# Altium schematic sheet Camera Schematic.SchDoc: Camera Schematic
size A4; Organization: Altium Limited; Address1: L3, 12a Rodborough Rd; Address2: Frenchs Forest; Address3: NSW; Address4: Australia 2086; DocumentNumber: 1; Revision: V1.0; SheetNumber: 1; SheetTotal: 1
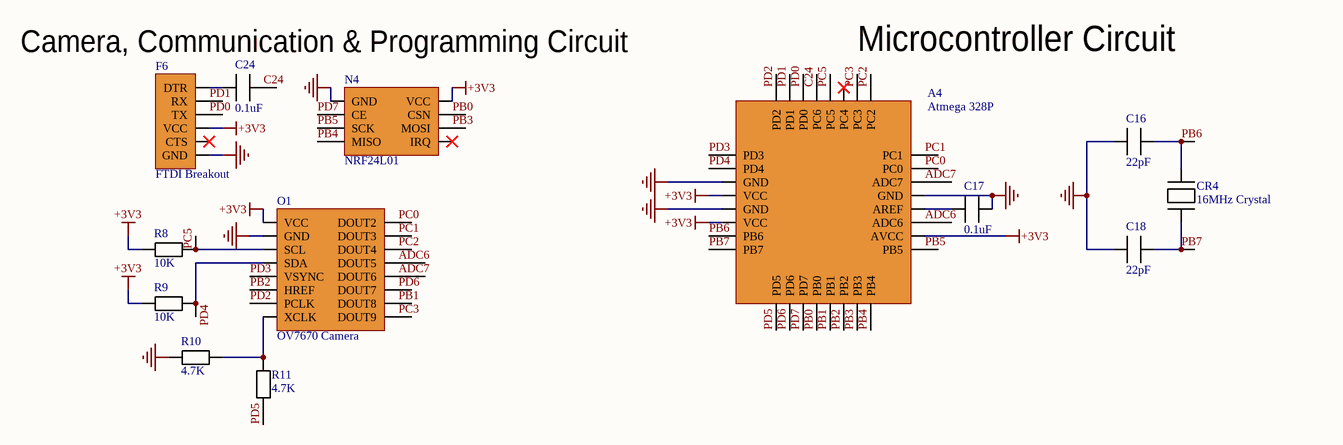
[diagram p0: Camera Schematic.SchDoc]

## Parts
A4  Atmega 328P  [ATMega328P]
C16  22pF  [22pF Capacitor]
C17  0.1uF  [0.1uF Capacitor]
C18  22pF  [22pF Capacitor]
C24  0.1uF  [0.1uF Capacitor]
CR4  16MHz Crystal  [16MHz Crystal]
F6  FTDI Breakout  [FTDI]
N4  NRF24L01  [NRF24L01]
O1  OV7670 Camera  [OV7670 Camera Module]
R8  10K  [10K Resistor]
R9  10K  [10K Resistor]
R10  4.7K  [4.7K Resistor]
R11  4.7K  [4.7K Resistor]

## Nets
+3V3: A4.4(VCC) A4.6(VCC) A4.18(AVCC) F6.4(VCC) N4.5(VCC) O1.1(VCC) R8.1 R9.1
GND: A4.3(GND) A4.5(GND) A4.21(GND) C16.1 C17.2 C18.1 F6.6(GND) N4.1(GND) O1.2(GND) R10.1
ADC6: A4.19(ADC6) O1.13(DOUT5)
ADC7: A4.22(ADC7) O1.12(DOUT6)
C24: A4.29(PC6) C24.2
PB0: A4.12(PB0) N4.6(CSN)
PB1: A4.13(PB1) O1.10(DOUT8)
PB2: A4.14(PB2) O1.6(HREF)
PB3: A4.15(PB3) N4.7(MOSI)
PB4: A4.16(PB4) N4.4(MISO)
PB5: A4.17(PB5) N4.3(SCK)
PB6: A4.7(PB6) C16.2 CR4.2
PB7: A4.8(PB7) C18.2 CR4.1
PC0: A4.23(PC0) O1.16(DOUT2)
PC1: A4.24(PC1) O1.15(DOUT3)
PC2: A4.25(PC2) O1.14(DOUT4)
PC3: A4.26(PC3) O1.9(DOUT9)
PC5: A4.28(PC5) O1.3(SCL) R8.2
PD0: A4.30(PD0) F6.3(TX)
PD1: A4.31(PD1) F6.2(RX)
PD2: A4.32(PD2) O1.7(PCLK)
PD3: A4.1(PD3) O1.5(VSYNC)
PD4: A4.2(PD4) O1.4(SDA) R9.2
PD5: A4.9(PD5) R11.1
PD6: A4.10(PD6) O1.11(DOUT7)
PD7: A4.11(PD7) N4.2(CE)
NetA4_20: A4.20(AREF) C17.1
NetC24_1: C24.1 F6.1(DTR)
NetO1_8: O1.8(XCLK) R10.2 R11.2

Not connected (* = marked no-connect by the designer): A4 27(PC4)*; F6 5(CTS)*; N4 8(IRQ)*

## Notes on the sheet
- Camera, Communication & Programming Circuit
- (near A4) Microcontroller Circuit
- Title
- Size:
- Date:
- A4
- Number:
- Time:
- Revision:
- Sheet
- of
- File:

## Library data of the parts
A4 = ATMEGA328PB-AUR: IC MCU 8BIT 32KB FLASH 32TQFP; Manufacturer: Microchip; Interface: I2C,SPI,UART,USART; Peripherals: Brown-out Detect/Reset,POR,PWM,WDT; Core Architecture: AVR; Frequency: 20MHz; Number of I/Os: 27; Oscillator Type: Internal; Supplier 1: Digi-Key; Manufacturer Part Number: ATMEGA328PB-AUR; RoHS: No; Category: Microcontrollers; Stock 1: 9971; Pricing 1: 1=1.42000, 25=1.30000, 100=1.18000 (USD); Case/Package: TQFP; Number of Pins: 32; Min Operating Temperature: -40°C; Max Operating Temperature: 85°C; Memory Type: FLASH; Packaging: Tape and Reel; Memory Size: 32KB; ComponentLink1URL: http://www.microchip.com/mymicrochip/filehandler.aspx?ddocname=en589666&src-supplier=Digi-Key; ComponentLink1Description: http://www.microchip.com/mymicrochip/filehandler.aspx?ddocname=en589666&src-supplier=Digi-Key; Supplier Part Number 1: ATMEGA328PB-AURCT-ND
C16 C18 = 06035A220JAT2A: Cap Ceramic 22pF 50V C0G 5% SMD 0603 125C Paper T/R; Manufacturer: Kyocera AVX; Insulation Resistance: 100GR; Temperature Coefficient: 30ppm/°C; Supplier 1: Digi-Key; Manufacturer Part Number: 06035A220JAT2A; RoHS: Yes; Category: Ceramic Capacitors; Stock 1: 678111; Pricing 1: 1=0.10000, 10=0.05600, 50=0.03040, 100=0.02480, 500=0.01772, 1000=0.01392 (USD); Mount: Surface Mount,PCB; Case/Package: 0603; Number of Pins: 2; Case Code (Imperial): 0603; Case Code (Metric): 1608; Contact Plating: Tin,Matte; Dielectric Material: Ceramic; Min Operating Temperature: -55°C; Max Operating Temperature: 125°C; Tolerance: 5%; Capacitance: 22pF; Voltage Rating (DC): 50V; Packaging: Tape and Reel; Dielectric: C0G; Voltage: 50V; Voltage Rating: 50V; Package Quantity: 1; Termination: SMD/SMT; Length: 1.6mm; Width: 0.81mm; Height: 0.63mm; Thickness: 0.035inch; Depth: 0.81mm; Radiation Hardening: No; REACH SVHC: No SVHC; Lead Free: Lead Free; ComponentLink1URL: https://datasheet.ciiva.com/11788/0900766b802d4697-11788031.pdf?src-supplier=RSComponents; ComponentLink1Description: https://datasheet.ciiva.com/11788/0900766b802d4697-11788031.pdf?src-supplier=RSComponents; ComponentLink2URL: https://datasheet.ciiva.com/16351/ccog-16351125.pdf?src-supplier=Future+Electronics; ComponentLink2Description: https://datasheet.ciiva.com/16351/ccog-16351125.pdf?src-supplier=Future+Electronics; ComponentLink3URL: https://datasheet.ciiva.com/1124/759117-1124728.pdf?src-supplier=Element14; ComponentLink3Description: https://datasheet.ciiva.com/1124/759117-1124728.pdf?src-supplier=Element14; ComponentLink4URL: https://datasheet.ciiva.com/7855/759117-7855064.pdf?src-supplier=Element14; ComponentLink4Description: https://datasheet.ciiva.com/7855/759117-7855064.pdf?src-supplier=Element14; ComponentLink5URL: https://datasheet.ciiva.com/150/ccog-150366.pdf?src-supplier=Digi-Key; ComponentLink5Description: https://datasheet.ciiva.com/150/ccog-150366.pdf?src-supplier=Digi-Key; ComponentLink6URL: https://datasheet.ciiva.com/150/ccog-150367.pdf?src-supplier=Digi-Key; ComponentLink6Description: https://datasheet.ciiva.com/150/ccog-150367.pdf?src-supplier=Digi-Key; Supplier Part Number 1: 478-1167-1-ND
C17 C24 = 06033C104KAT4A: CAP CER 0.1UF 25V X7R 0603; Manufacturer: Kyocera AVX; Capacitance: 100nF; Tolerance: 10%; Supplier 1: Digi-Key; Manufacturer Part Number: 06033C104KAT4A; RoHS: Yes; Category: Ceramic Capacitors; Stock 1: 6112957; Pricing 1: 1=0.10000, 10=0.04200, 50=0.02320, 100=0.01890, 500=0.01348, 1000=0.01059, 2500=0.00962, 5000=0.00886 (USD); Mount: Surface Mount; Case/Package: 0603; Number of Pins: 2; Case Code (Metric): 1608; Case Code (Imperial): 0603; Min Operating Temperature: -55°C; Max Operating Temperature: 125°C; Packaging: Tape and Reel; Voltage Rating (DC): 25V; Dielectric: X7R; Package Quantity: 1; Voltage Rating: 25V; Termination: SMD/SMT; Length: 1.6mm; Width: 0.032inch; Height: 0.9mm; Thickness: 0.035inch; Depth: 0.81mm; REACH SVHC: No SVHC; Lead Free: Lead Free; ComponentLink1URL: https://datasheet.ciiva.com/22619/1679506-22619862.pdf?src-supplier=Element14; ComponentLink1Description: https://datasheet.ciiva.com/22619/1679506-22619862.pdf?src-supplier=Element14; ComponentLink2URL: https://datasheet.ciiva.com/28613/1679506-28613035.pdf?src-supplier=Element14; ComponentLink2Description: https://datasheet.ciiva.com/28613/1679506-28613035.pdf?src-supplier=Element14; ComponentLink3URL: https://datasheet.ciiva.com/6277/cx7r-6277758.pdf?src-supplier=Digi-Key; ComponentLink3Description: https://datasheet.ciiva.com/6277/cx7r-6277758.pdf?src-supplier=Digi-Key; ComponentLink4URL: https://datasheet.ciiva.com/6277/cx7r-6277759.pdf?src-supplier=Digi-Key; ComponentLink4Description: https://datasheet.ciiva.com/6277/cx7r-6277759.pdf?src-supplier=Digi-Key; Supplier Part Number 1: 478-7018-1-ND
CR4 = ECS-160-20-3X-TR: CRYSTAL 16.0000MHZ 20PF SMD; Manufacturer: ECS International; Frequency Tolerance: 30ppm; ESR (Equivalent Series Resistance): 50R; Frequency Stability: 50ppm; Supplier 1: Digi-Key; Manufacturer Part Number: ECS-160-20-3X-TR; RoHS: Yes; Category: Crystals; Stock 1: 6685; Pricing 1: 1=0.35000, 10=0.28800, 50=0.25880, 100=0.23000, 500=0.21850, 1000=0.18400 (USD); Mount: Surface Mount; Min Operating Temperature: -10°C; Max Operating Temperature: 70°C; Package Quantity: 1; Frequency: 16MHz; Load Capacitance: 20pF; Packaging: Tape and Reel; Tolerance: 30ppm; Termination: SMD/SMT; Length: 0.276inch; Width: 0.161inch; Height: 0.091inch; Lead Free: Lead Free; ComponentLink1URL: https://datasheet.ciiva.com/852/csm-3x-852328.pdf?src-supplier=Digi-Key; ComponentLink1Description: https://datasheet.ciiva.com/852/csm-3x-852328.pdf?src-supplier=Digi-Key; ComponentLink2URL: https://datasheet.ciiva.com/852/csm-3x-852329.pdf?src-supplier=Digi-Key; ComponentLink2Description: https://datasheet.ciiva.com/852/csm-3x-852329.pdf?src-supplier=Digi-Key; ComponentLink3URL: https://datasheet.ciiva.com/852/csm-3x-852330.pdf?src-supplier=Digi-Key; ComponentLink3Description: https://datasheet.ciiva.com/852/csm-3x-852330.pdf?src-supplier=Digi-Key; Supplier Part Number 1: XC1776CT-ND
F6 = FTDI: FTDI USB to TTL serial converter module
N4 = NRF24L01: 3.3V NRF24L01 WIRELESS RF MODULE
O1 = OV7670 Camera Module: CMOS OV7670 Camera Module / 1/6-Inch 0.3-Megapixel Module
R8 R9 = RNCP0603FTD10K0: RES 10K OHM 1% 1/8W 0603; Manufacturer: Stackpole Electronics; Resistance: 10kR; Max Power Dissipation: 125mW; Temperature Coefficient: 100ppm/°C; Supplier 1: Digi-Key; Manufacturer Part Number: RNCP0603FTD10K0; RoHS: Yes; Category: Chip SMD Resistors; Stock 1: 180255; Pricing 1: 1=0.10000, 10=0.05800, 100=0.02360, 1000=0.01060, 2500=0.00920 (USD); Mount: Surface Mount; Case/Package: 0603; Contact Plating: Tin,Matte; Case Code (Imperial): 0603; Case Code (Metric): 1608; Min Operating Temperature: -55°C; Max Operating Temperature: 155°C; Resistor Type: Thin Film; Number of Terminations: 2; Packaging: Tape and Reel; Tolerance: 1%; Features: Moisture Resistant,Anti-Sulfur; Length: 0.059inch; Width: 0.031inch; Height: 0.02inch; Radiation Hardening: No; Lead Free: Lead Free; ComponentLink1URL: https://www.seielect.com/Catalog/SEI-rncp.pdf?src-supplier=Avnet; ComponentLink1Description: https://www.seielect.com/Catalog/SEI-rncp.pdf?src-supplier=Avnet; ComponentLink2URL: https://www.seielect.com/catalog/SEI-Packaging.pdf?src-supplier=Digi-Key; ComponentLink2Description: https://www.seielect.com/catalog/SEI-Packaging.pdf?src-supplier=Digi-Key; ComponentLink3URL: https://www.seielect.com/Catalog/SEI-rncp.pdf?src-supplier=Digi-Key; ComponentLink3Description: https://www.seielect.com/Catalog/SEI-rncp.pdf?src-supplier=Digi-Key; Supplier Part Number 1: RNCP0603FTD10K0CT-ND
R10 R11 = RMCF0603FT4K70: Res Thick Film 0603 4.7K Ohm 1% 1/10W 100ppm/C Molded SMD SMD Paper T/R; Manufacturer: Stackpole Electronics; Max Power Dissipation: 100mW; Temperature Coefficient: 100ppm/°C; Resistance: 4.7kR; Supplier 1: Digi-Key; Manufacturer Part Number: RMCF0603FT4K70; RoHS: Yes; Category: Chip SMD Resistors; Stock 1: 603007; Pricing 1: 1=0.10000, 10=0.01500, 100=0.00590, 1000=0.00265, 2500=0.00230 (USD); Mount: Surface Mount; Case/Package: 0603; Contact Plating: Tin,Matte; Case Code (Imperial): 0603; Case Code (Metric): 1608; Min Operating Temperature: -55°C; Max Operating Temperature: 155°C; Packaging: Tape and Reel; Tolerance: 1%; Power Rating: 100mW; Features: Automotive AEC-Q200; Resistor Type: Thick Film; Number of Terminations: 2; Length: 1.55mm; Width: 0.031inch; Height: 0.022inch; Depth: 0.8mm; Radiation Hardening: No; Military Standard: Not; Lead Free: Lead Free; ComponentLink1URL: https://datasheet.ciiva.com/26835/getdatasheetpartid-486078-26835642.pdf?src-supplier=Verical; ComponentLink1Description: https://datasheet.ciiva.com/26835/getdatasheetpartid-486078-26835642.pdf?src-supplier=Verical; Supplier Part Number 1: RMCF0603FT4K70CT-ND